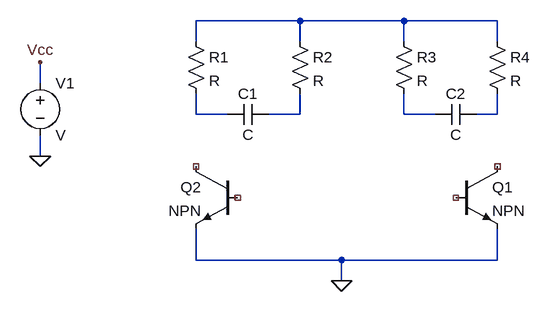
[diagram p0: schematic Draft1.asc]
Draft1.asc, the LTspice schematic file:
Version 4
SHEET 1 880 680
WIRE 272 -80 112 -80
WIRE 432 -80 272 -80
WIRE 576 -80 432 -80
WIRE 112 -48 112 -80
WIRE 272 -48 272 -80
WIRE 432 -48 432 -80
WIRE 576 -48 576 -80
WIRE -128 16 -128 -16
WIRE 112 64 112 32
WIRE 160 64 112 64
WIRE 272 64 272 32
WIRE 272 64 224 64
WIRE 432 64 432 32
WIRE 480 64 432 64
WIRE 576 64 576 32
WIRE 576 64 544 64
WIRE -128 128 -128 96
WIRE 112 288 112 240
WIRE 336 288 112 288
WIRE 576 288 576 240
WIRE 576 288 336 288
WIRE 336 320 336 288
FLAG -128 128 0
FLAG -128 -16 Vcc
FLAG 336 320 0
SYMBOL npn 512 144 R0
SYMATTR InstName Q1
SYMBOL npn 176 144 M0
SYMATTR InstName Q2
SYMBOL res 96 -64 R0
SYMATTR InstName R1
SYMBOL res 256 -64 R0
SYMATTR InstName R2
SYMBOL res 416 -64 R0
SYMATTR InstName R3
SYMBOL res 560 -64 R0
SYMATTR InstName R4
SYMBOL cap 224 48 R90
WINDOW 0 0 32 VBottom 2
WINDOW 3 32 32 VTop 2
SYMATTR InstName C1
SYMBOL cap 544 48 R90
WINDOW 0 0 32 VBottom 2
WINDOW 3 32 32 VTop 2
SYMATTR InstName C2
SYMBOL voltage -128 0 R0
SYMATTR InstName V1

The netlist it stands for:
* Draft1.asc
Q1 NC_01 NC_02 0 0 NPN
Q2 NC_03 NC_04 0 0 NPN
R1 N001 N002 R
R2 N001 N003 R
R3 N001 N004 R
R4 N001 N005 R
C1 N003 N002 C
C2 N005 N004 C
V1 Vcc 0 V
.model NPN NPN
.model PNP PNP
.lib standard.bjt
.backanno
.end